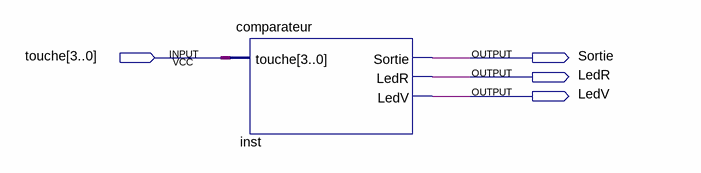
[diagram p0: schematic sheet]
// Quartus schematic comparateur.bdf as structural Verilog: 1 symbols, 4 pins
module comparateur (
  input  [3:0] touche,
  output Sortie,
  output LedR,
  output LedV
);

  comparateur inst (.touche(touche), .Sortie(Sortie), .LedR(LedR), .LedV(LedV));
endmodule
